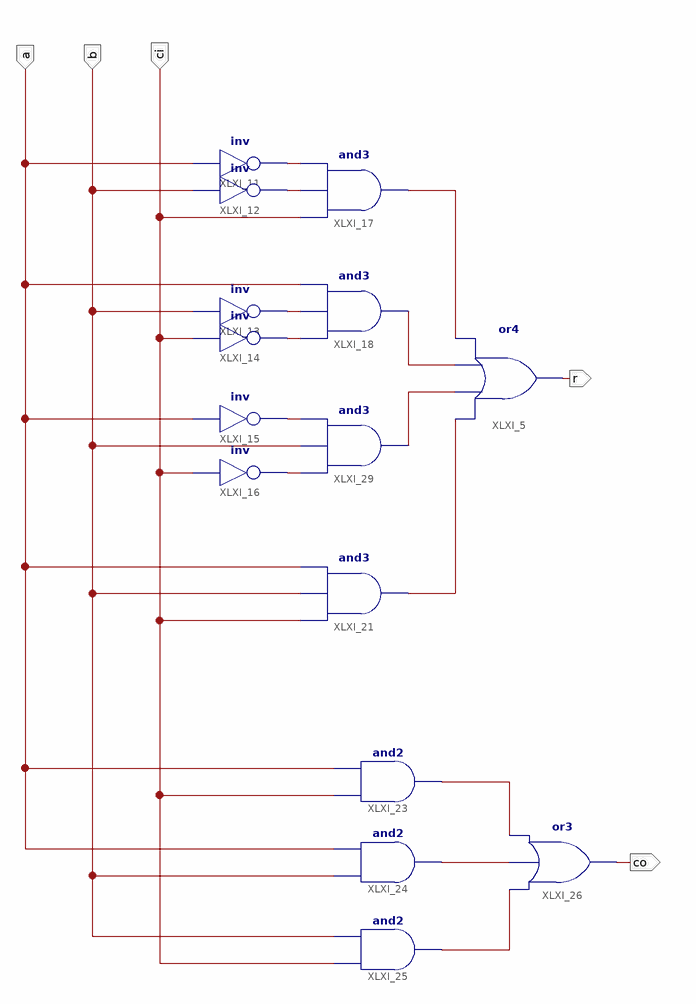
[diagram p0: schematic sheet 1]
// Xilinx ISE schematic add1b.sch (spartan3e) as structural Verilog: 15 symbols, 5 ports
module add1b (
  input  b,
  input  ci,
  input  a,
  output r,
  output co
);

  wire XLXN_3, XLXN_4, XLXN_5, XLXN_6, XLXN_12, XLXN_13, XLXN_14, XLXN_15, XLXN_16, XLXN_18, XLXN_19,
       XLXN_20, XLXN_23;

  or XLXI_5 (r, XLXN_6, XLXN_5, XLXN_4, XLXN_3);
  not XLXI_11 (XLXN_13, a);
  not XLXI_12 (XLXN_12, b);
  not XLXI_13 (XLXN_15, b);
  not XLXI_14 (XLXN_14, ci);
  not XLXI_16 (XLXN_16, ci);
  and XLXI_17 (XLXN_3, ci, XLXN_12, XLXN_13);
  and XLXI_18 (XLXN_4, XLXN_14, XLXN_15, a);
  and XLXI_21 (XLXN_6, ci, b, a);
  and XLXI_23 (XLXN_18, ci, a);
  and XLXI_24 (XLXN_19, b, a);
  and XLXI_25 (XLXN_20, ci, b);
  or XLXI_26 (co, XLXN_20, XLXN_19, XLXN_18);
  not XLXI_15 (XLXN_23, a);
  and XLXI_29 (XLXN_5, XLXN_16, b, XLXN_23);
endmodule
